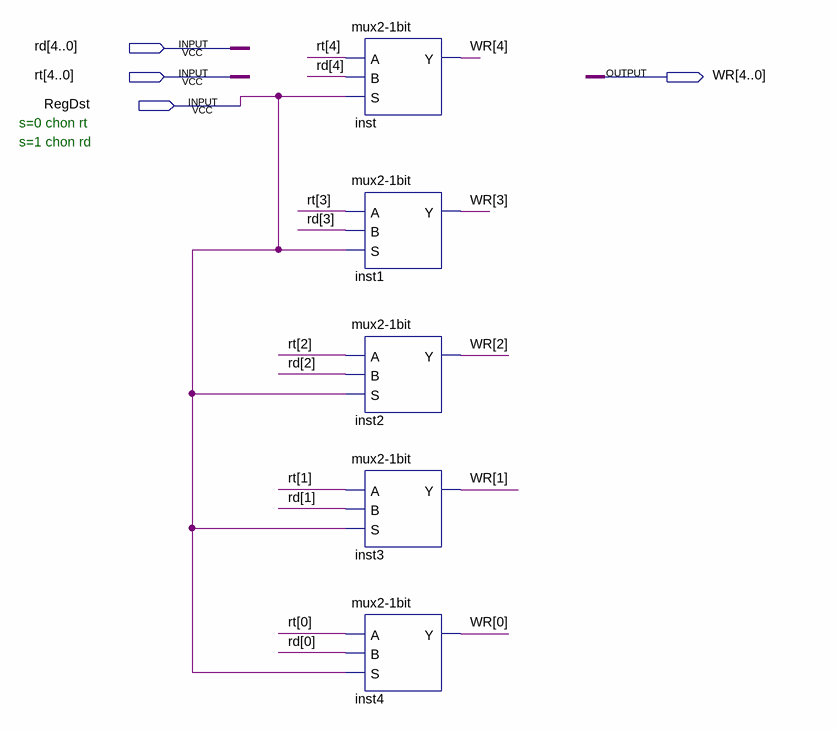
[diagram p0: schematic sheet]
// Quartus schematic mux21_5bits.bdf as structural Verilog: 5 symbols, 4 pins
module mux21_5bits (
  input  [4:0] rd,
  input  [4:0] rt,
  input  RegDst,
  output [4:0] WR
);

  \mux2-1bit  inst (.A(rt[4]), .B(rd[4]), .S(RegDst), .Y(WR[4]));
  \mux2-1bit  inst1 (.A(rt[3]), .B(rd[3]), .S(RegDst), .Y(WR[3]));
  \mux2-1bit  inst2 (.A(rt[2]), .B(rd[2]), .S(RegDst), .Y(WR[2]));
  \mux2-1bit  inst3 (.A(rt[1]), .B(rd[1]), .S(RegDst), .Y(WR[1]));
  \mux2-1bit  inst4 (.A(rt[0]), .B(rd[0]), .S(RegDst), .Y(WR[0]));

  // Notes on the sheet:
  //   s=0 chon rt
  //   s=1 chon rd
endmodule
